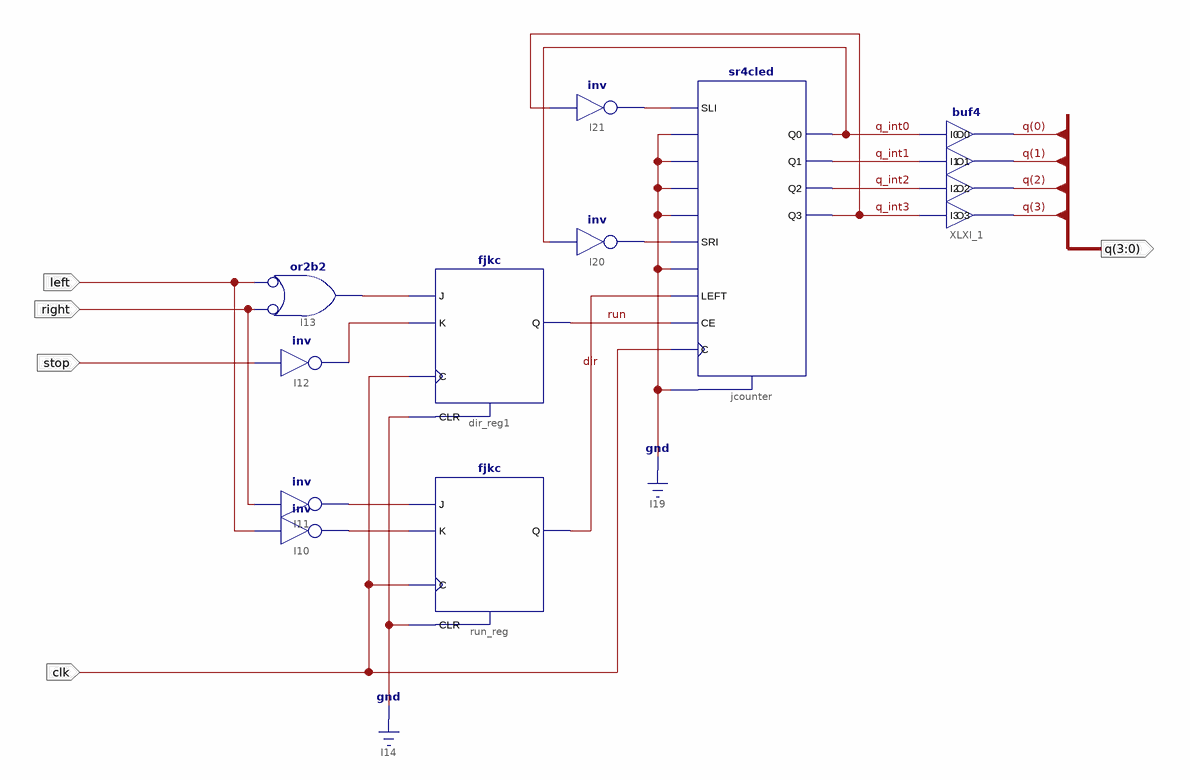
[diagram p0: schematic sheet 1]
// Xilinx ISE schematic jc2_top.sch (xc9500xl) as structural Verilog: 10 symbols, 5 ports
module jc2_top (
  input  clk,
  input  stop,
  input  left,
  input  right,
  output [3:0] q
);

  wire dir, q_int0, q_int1, q_int2, q_int3, run, XLXN_10, XLXN_11, XLXN_19, XLXN_20, XLXN_21, XLXN_22;

  sr4cled jcounter (
    .C(clk), .CE(run), .CLR(1'b0), .D0(1'b0), .D1(1'b0), .D2(1'b0), .D3(1'b0), .L(1'b0), .LEFT(dir),
    .SLI(XLXN_11), .SRI(XLXN_10), .Q0(q_int0), .Q1(q_int1), .Q2(q_int2), .Q3(q_int3));
  not I20 (XLXN_10, q_int0);
  not I21 (XLXN_11, q_int3);
  not I10 (XLXN_19, left);
  not I11 (XLXN_20, right);
  not I12 (XLXN_21, stop);
  or I13 (XLXN_22, ~right, ~left);  // or2b2
  fjkc run_reg (.C(clk), .CLR(1'b0), .J(XLXN_20), .K(XLXN_19), .Q(dir));
  fjkc dir_reg1 (.C(clk), .CLR(1'b0), .J(XLXN_22), .K(XLXN_21), .Q(run));
  buf4 XLXI_1 (.I0(q_int0), .I1(q_int1), .I2(q_int2), .I3(q_int3), .O0(q[0]), .O1(q[1]), .O2(q[2]), .O3(q[3]));
endmodule
